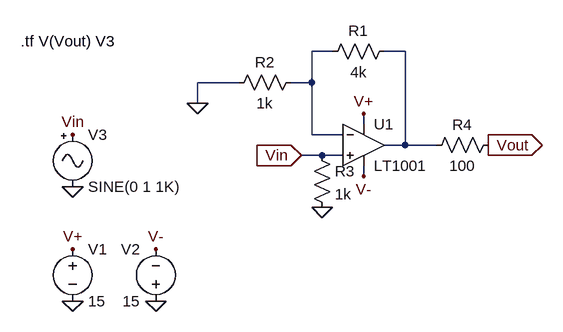
[diagram p0: schematic DC Transfer.asc]
DC Transfer.asc, the LTspice schematic file:
Version 4
SHEET 1 976 680
WIRE 624 -384 592 -384
WIRE 736 -384 704 -384
WIRE 480 -336 416 -336
WIRE 592 -336 592 -384
WIRE 592 -336 560 -336
WIRE 416 -304 416 -336
WIRE 672 -272 672 -288
WIRE 592 -256 592 -336
WIRE 640 -256 592 -256
WIRE 736 -240 736 -384
WIRE 736 -240 704 -240
WIRE 784 -240 736 -240
WIRE 608 -224 576 -224
WIRE 640 -224 608 -224
WIRE 672 -192 672 -208
FLAG 224 0 0
FLAG 352 0 0
FLAG 224 -80 V+
FLAG 352 -80 V-
FLAG 672 -288 V+
FLAG 672 -192 V-
FLAG 224 -176 0
FLAG 224 -256 Vin
FLAG 576 -224 Vin
IOPIN 576 -224 In
FLAG 416 -304 0
FLAG 864 -240 Vout
IOPIN 864 -240 Out
FLAG 608 -144 0
SYMBOL voltage 224 -96 R0
WINDOW 123 0 0 Left 0
WINDOW 39 0 0 Left 0
SYMATTR InstName V1
SYMATTR Value 15
SYMBOL voltage 352 16 R180
WINDOW 0 24 96 Left 2
WINDOW 3 24 16 Left 2
WINDOW 123 0 0 Left 0
WINDOW 39 0 0 Left 0
SYMATTR InstName V2
SYMATTR Value 15
SYMBOL OpAmps\\LT1001 672 -304 R0
SYMATTR InstName U1
SYMBOL Misc\\signal 224 -272 R0
WINDOW 123 24 81 Left 2
WINDOW 39 0 0 Left 0
SYMATTR InstName V3
SYMBOL res 720 -400 R90
WINDOW 0 0 56 VBottom 2
WINDOW 3 32 56 VTop 2
SYMATTR InstName R1
SYMATTR Value 4k
SYMBOL res 576 -352 R90
WINDOW 0 0 56 VBottom 2
WINDOW 3 32 56 VTop 2
SYMATTR InstName R2
SYMATTR Value 1k
SYMBOL res 592 -240 R0
SYMATTR InstName R3
SYMATTR Value 1k
SYMBOL res 880 -256 R90
WINDOW 0 0 56 VBottom 2
WINDOW 3 32 56 VTop 2
SYMATTR InstName R4
SYMATTR Value 100
TEXT 144 -400 Left 2 !.tf V(Vout) V3

The netlist it stands for:
* DC Transfer.asc
V1 V+ 0 15
V2 0 V- 15
XU1 Vin N001 V+ V- N002 LT1001  ; pins In+ In- V+ V- OUT
V3 Vin 0 SINE(0 1 1K)
R1 N002 N001 4k
R2 N001 0 1k
R3 Vin 0 1k
R4 Vout N002 100
.tf V(Vout) V3
.lib LTC.lib
.backanno
.end